# Altium schematic sheet HBridge_Motor_Driver.SchDoc
size A
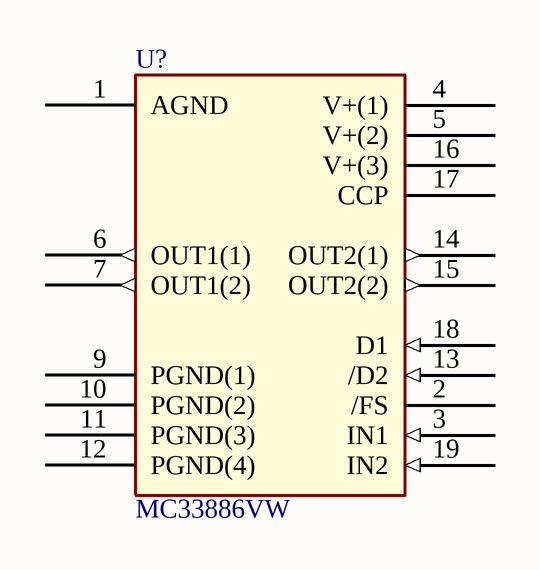
[diagram p0: HBridge_Motor_Driver.SchDoc]

## Parts
U?  MC33886VW  [POWERSOP20]

## Nets

Not connected (* = marked no-connect by the designer): U? 1(AGND) 2(/FS) 3(IN1) 4(V+(1)) 5(V+(2)) 6(OUT1(1)) 7(OUT1(2)) 9(PGND(1)) 10(PGND(2)) 11(PGND(3)) 12(PGND(4)) 13(/D2) 14(OUT2(1)) 15(OUT2(2)) 16(V+(3)) 17(CCP) 18(D1) 19(IN2)

## Library data of the parts
U? = MC33886VW: IC MOTOR DRIVER PAR 20HSOP; MPN: MC33886PVW; PN: MC33886PVW-ND; URL: http://www.digikey.ca/product-detail/en/MC33886PVW/MC33886PVW-ND